# Altium schematic sheet 50V 100uF 8X121_50V 100uF 8X12.schdoc.schdoc
size 124 x 99 mm
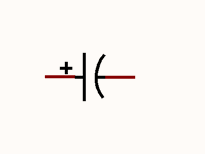
[diagram p0: 50V 100uF 8X121_50V 100uF 8X12.schdoc.schdoc]

## Parts
C?  KM107M050F12RR0VH2FP0  [CAP-TH_BD8.0-P3.50-D0.6-FD]  (value not drawn)

## Nets

Not connected (* = marked no-connect by the designer): C? 1 2

## Library data of the parts
C? = KM107M050F12RR0VH2FP0: Manufacturer: CX(承兴); Symbol: 50V 100uF 8X12; Add into BOM: yes; Value: 100uF; Tolerance: ±20%; Rated Voltage: 50V; φD: 8mm; L: 12mm; Lifetime @ Temp: 2000hrs@105℃; Device: KM107M050F12RR0VH2FP0; LCSC Part Name: 100uF ±20% 50V; Supplier Part: C2749; Manufacturer Part: KM107M050F12RR0VH2FP0; Supplier Footprint: 插件,D8xL12mm; JLCPCB Part Class: Extended Part; Datasheet: https://atta.szlcsc.com/upload/public/pdf/source/20211027/06D6BA3719C264B639DC286D935D03EA.pdf; Supplier: LCSC; Convert to PCB: yes; Lead Spacing: 3.5mm